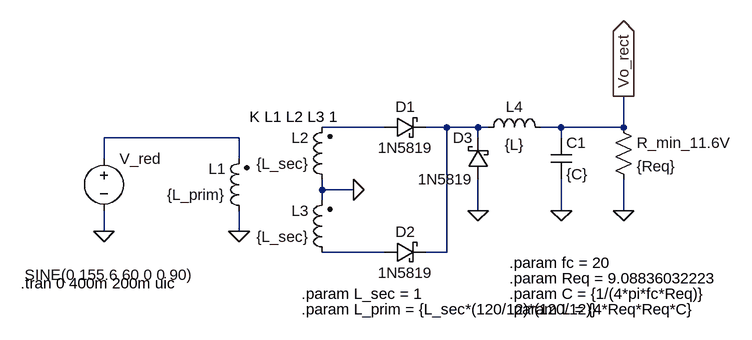
[diagram p0: schematic Rectifier.asc]
Rectifier.asc, the LTspice schematic file:
Version 4
SHEET 1 880 700
WIRE 368 384 272 384
WIRE 464 384 432 384
WIRE 512 384 464 384
WIRE 528 384 512 384
WIRE 640 384 608 384
WIRE 736 384 736 336
WIRE 736 384 640 384
WIRE 144 400 -64 400
WIRE 512 400 512 384
WIRE 640 400 640 384
WIRE -64 432 -64 400
WIRE 144 432 144 400
WIRE 272 480 272 464
WIRE 320 480 272 480
WIRE 272 496 272 480
WIRE 512 512 512 464
WIRE 640 512 640 464
WIRE 736 512 736 464
WIRE -64 544 -64 512
WIRE 144 544 144 512
WIRE 368 576 272 576
WIRE 464 576 464 384
WIRE 464 576 432 576
FLAG -64 544 0
FLAG 144 544 0
FLAG 320 480 0
FLAG 736 336 Vo_rect
IOPIN 736 336 Out
FLAG 640 512 0
FLAG 736 512 0
FLAG 512 512 0
SYMBOL ind2 160 528 R180
WINDOW 0 36 80 Left 2
WINDOW 3 36 40 Left 2
SYMATTR InstName L1
SYMATTR Value {L_prim}
SYMATTR SpiceLine Rser=1
SYMBOL voltage -64 416 R0
WINDOW 3 -122 195 Left 2
WINDOW 123 0 0 Left 0
WINDOW 39 0 0 Left 0
SYMATTR Value SINE(0 155.6 60 0 0 90)
SYMATTR InstName V_red
SYMBOL schottky 368 400 R270
WINDOW 0 32 32 VTop 2
WINDOW 3 0 32 VBottom 2
SYMATTR InstName D1
SYMATTR Value 1N5819
SYMATTR Description Diode
SYMATTR Type diode
SYMBOL cap 624 400 R0
SYMATTR InstName C1
SYMATTR Value {C}
SYMBOL ind2 288 480 R180
WINDOW 0 36 80 Left 2
WINDOW 3 36 40 Left 2
SYMATTR InstName L2
SYMATTR Value {L_sec}
SYMBOL ind2 288 592 R180
WINDOW 0 36 80 Left 2
WINDOW 3 36 40 Left 2
SYMATTR InstName L3
SYMATTR Value {L_sec}
SYMBOL schottky 368 592 R270
WINDOW 0 32 32 VTop 2
WINDOW 3 0 32 VBottom 2
SYMATTR InstName D2
SYMATTR Value 1N5819
SYMATTR Description Diode
SYMATTR Type diode
SYMBOL res 720 368 R0
SYMATTR InstName R_min_11.6V
SYMATTR Value {Req}
SYMBOL ind 512 400 R270
WINDOW 0 32 56 VTop 2
WINDOW 3 5 56 VBottom 2
SYMATTR InstName L4
SYMATTR Value {L}
SYMATTR SpiceLine Rser=0.4
SYMBOL schottky 528 464 R180
WINDOW 0 24 64 Left 2
WINDOW 3 24 0 Left 2
SYMATTR InstName D3
SYMATTR Value 1N5819
SYMATTR Description Diode
SYMATTR Type diode
TEXT 160 368 Left 2 !K L1 L2 L3 1
TEXT -192 624 Left 2 !.tran 0 400m 200m uic
TEXT 560 616 Left 2 !.param Req = 9.08836032223
TEXT 560 640 Left 2 !.param C = {1/(4*pi*fc*Req)}
TEXT 560 664 Left 2 !.param L = {4*Req*Req*C}
TEXT 560 592 Left 2 !.param fc = 20
TEXT 240 640 Left 2 !.param L_sec = 1
TEXT 240 664 Left 2 !.param L_prim = {L_sec*(120/12)*(120/12)}

The netlist it stands for:
* Rectifier.asc
L1 0 N003 {L_prim} Rser=1
V_red N003 0 SINE(0 155.6 60 0 0 90)
D1 N001 N002 1N5819
C1 Vo_rect 0 {C}
L2 0 N001 {L_sec}
L3 N004 0 {L_sec}
D2 N004 N002 1N5819
R_min_11.6V Vo_rect 0 {Req}
L4 N002 Vo_rect {L} Rser=0.4
D3 0 N002 1N5819
.model D D
.lib standard.dio
K L1 L2 L3 1
.tran 0 400m 200m uic
.param Req = 9.08836032223
.param C = {1/(4*pi*fc*Req)}
.param L = {4*Req*Req*C}
.param fc = 20
.param L_sec = 1
.param L_prim = {L_sec*(120/12)*(120/12)}
.backanno
.end